# Altium schematic sheet SAML21_Xplained_Pro_Connectors.SchDoc: Extension connectors
size A3; Organization: ATMEL Norway; Address1: Vestre Rosten 79; Address2: N-7075 TILLER; Address3: NORWAY; DocumentNumber: A09-2241; Revision: 4; SheetNumber: 4; SheetTotal: 10; PageSetup: Record=PageOptions|CenterHorizontal=True|CenterVertical=True|PrintScale=1.01|XCorrection=1.00|YCorrection=1.00|PrintKind=1|BorderSize=5000000|LeftOffset=0|BottomOffset=0|Orientation=2|PaperLength=1000|PaperWidth=1000|Scale=100|PaperSource=7|PrintQuality=-4|MediaType=1|DitherType=10|PaperKind=A3 (297 x 420 mm)|PrintScaleMode=1
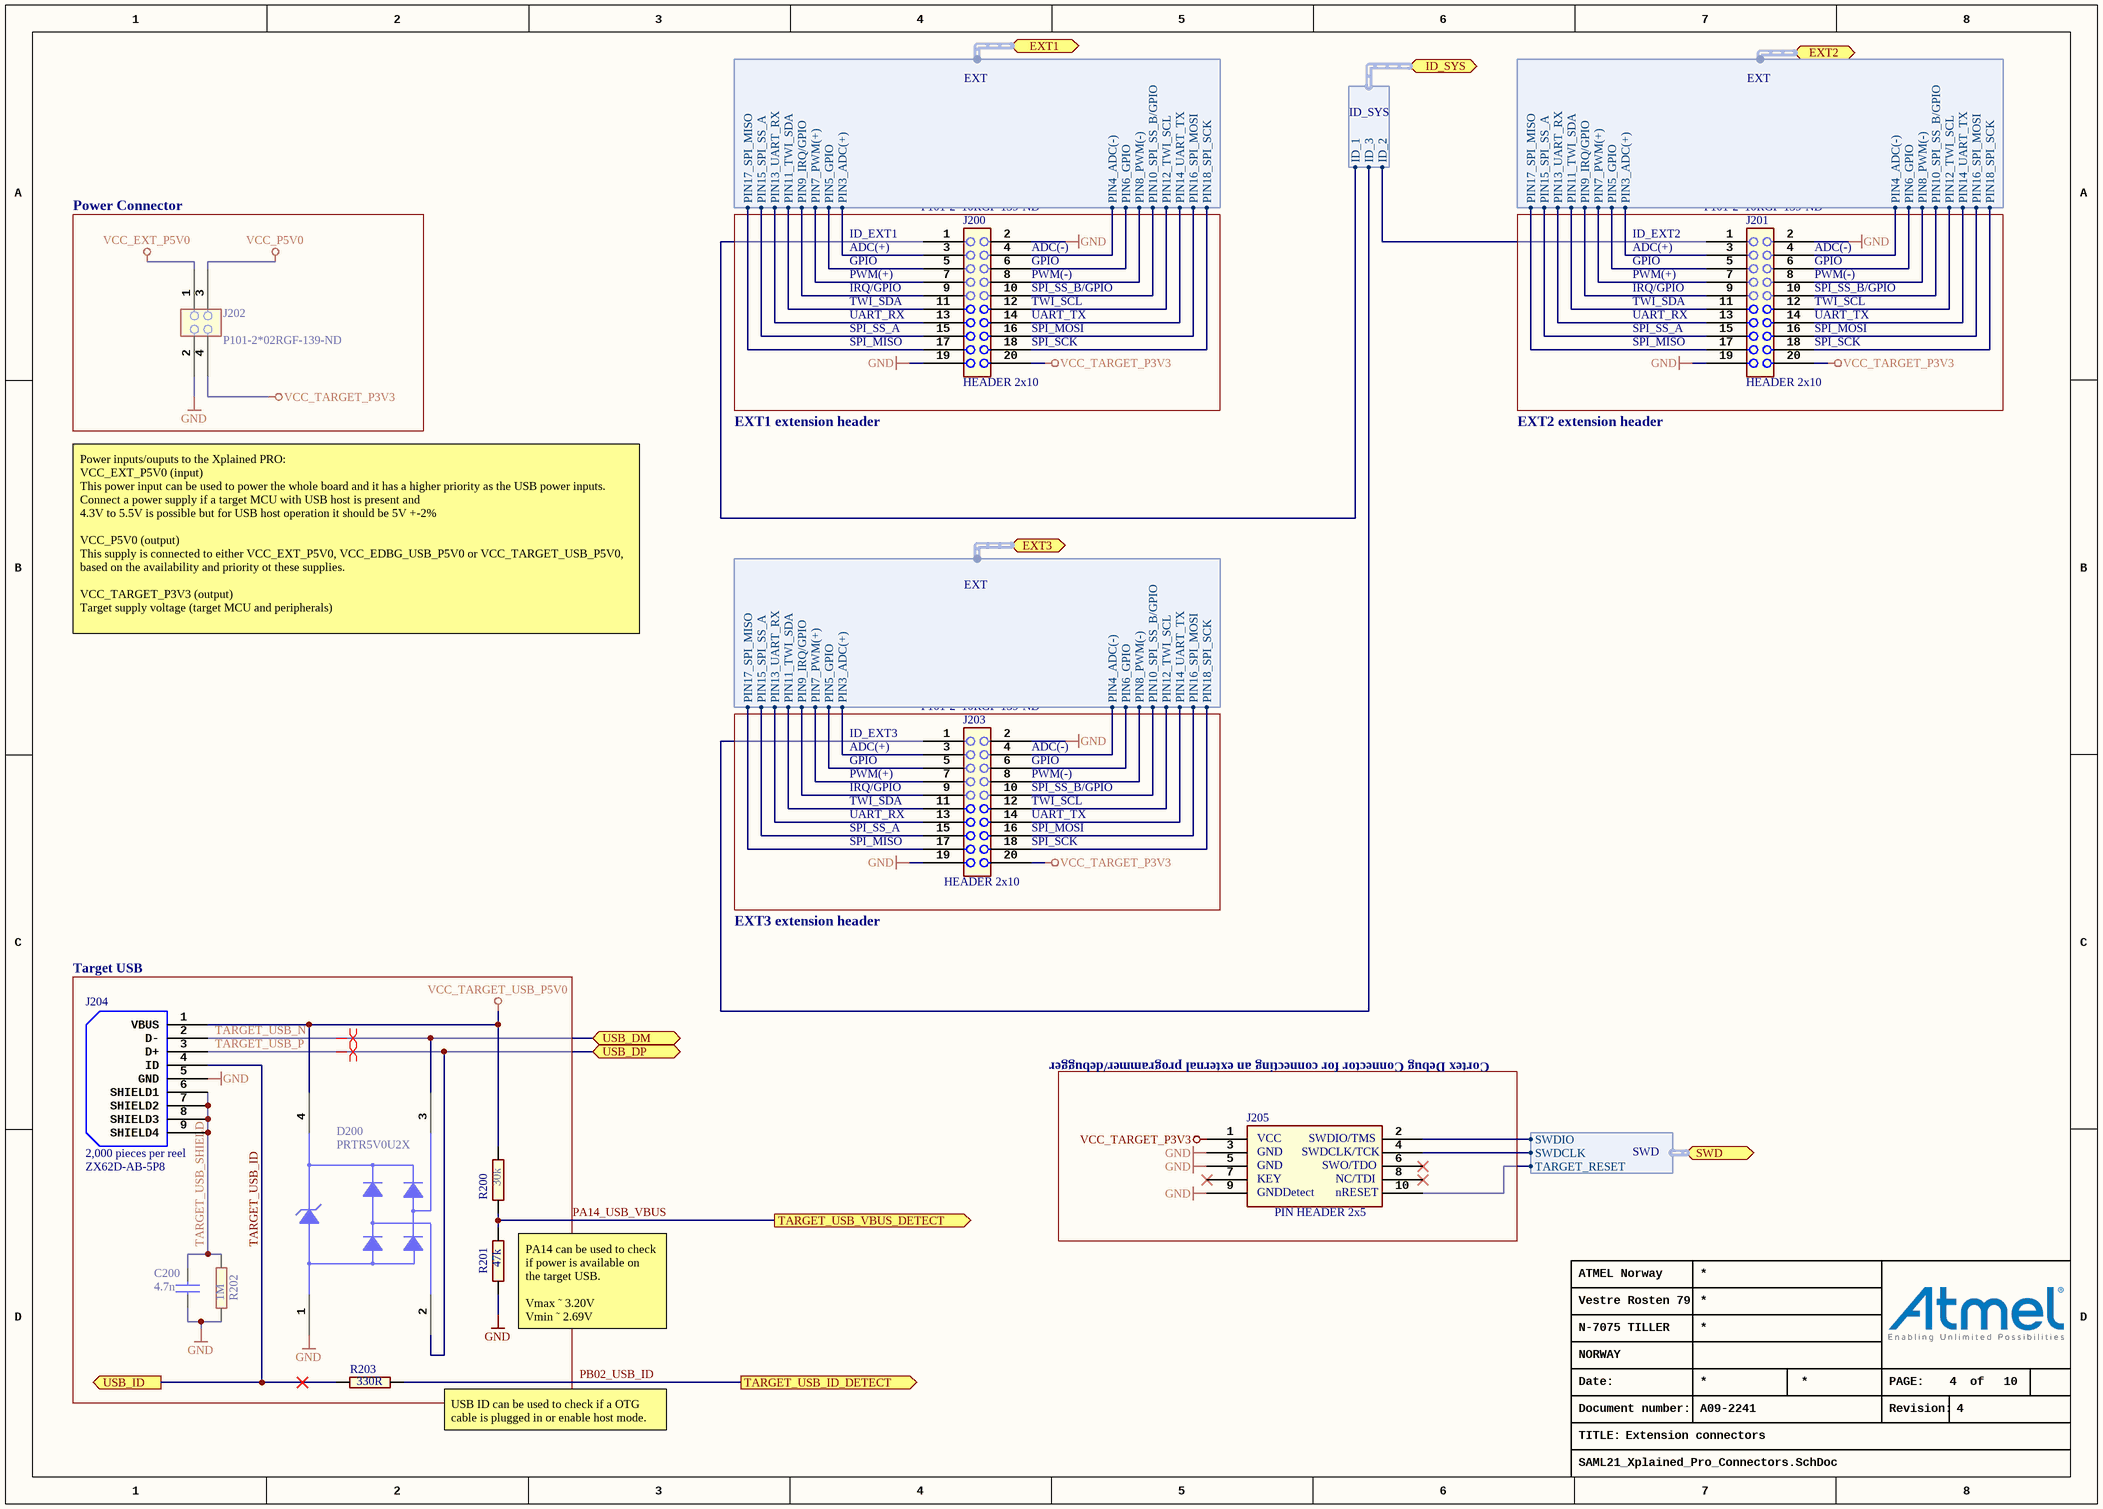
[diagram p0: SAML21_Xplained_Pro_Connectors.SchDoc]

## Parts
C200  value 4.7n  [AP1-00053]  (hidden comment: CAP-NONPOL)
D200  PRTR5V0U2X  [AP4-00001]
J200  HEADER 2x10  value P101-2*10RGF-139-ND  [AP8-00622]
J201  HEADER 2x10  value P101-2*10RGF-139-ND  [AP8-00622]
J202  value P101-2*02RGF-139-ND  [AP8-00628]  (hidden comment: HEADER 2x2)
J203  HEADER 2x10  value P101-2*10RGF-139-ND  [AP8-00622]
J204  2,000 pieces per reel  value ZX62D-AB-5P8  [AP8-00852]
J205  value PIN HEADER 2x5  [AP8-00257]  (hidden comment: HEADER 2x5)
R200  value 30k  [AP2-00011]  (hidden comment: R2)
R201  value 47k  [AP2-00011]  (hidden comment: R2)
R202  value 1M  [AP2-00011]  (hidden comment: R2)
R203  value 330R  [AP2-00011]  (hidden comment: R2)

## Blocks framed on the sheet
Power Connector: J202
Target USB: C200 D200 J204 R200-R203

## Ports
EXT1 (harness EXT), EXT2 (harness EXT), EXT3 (harness EXT), ID_SYS (harness ID_SYS), SWD (harness SWD), TARGET_USB_ID_DETECT (out), TARGET_USB_VBUS_DETECT (out), USB_DM (bidir), USB_DP (bidir), USB_ID (out)

## Harnesses
ID_SYS: ID_1, ID_2, ID_3
EXT: PIN3_ADC(+), PIN4_ADC(-), PIN5_GPIO, PIN6_GPIO, PIN7_PWM(+), PIN8_PWM(-), PIN9_IRQ/GPIO, PIN10_SPI_SS_B/GPIO, PIN11_TWI_SDA, PIN12_TWI_SCL, PIN13_UART_RX, PIN14_UART_TX, PIN15_SPI_SS_A, PIN16_SPI_MOSI, PIN17_SPI_MISO, PIN18_SPI_SCK
SWD: SWDCLK, SWDIO, TARGET_RESET

## Nets
GND: C200.1 D200.1(GND) J200.2 J200.19 J201.2 J201.19 J202.2 J203.2 J203.19 J204.5(GND) J205.3 J205.5 J205.9 R201.1 R202.1
VCC_EXT_P5V0: J202.1
VCC_P5V0: J202.3
VCC_TARGET_P3V3: J200.20 J201.20 J202.4 J203.20 J205.1
VCC_TARGET_USB_P5V0: D200.4(VCC) J204.1(VBUS) R200.2
PA14_USB_VBUS: R200.1 R201.2 ; port TARGET_USB_VBUS_DETECT
PB02_USB_ID: R203.2 ; port TARGET_USB_ID_DETECT
TARGET_USB_ID: J204.4(ID) R203.1 ; port USB_ID
TARGET_USB_N: D200.3(I/O_2) J204.2(D-) ; port USB_DM
TARGET_USB_P: D200.2(I/O_1) J204.3(D+) ; port USB_DP
TARGET_USB_SHIELD: C200.2 J204.6(SHIELD1) J204.7(SHIELD2) J204.8(SHIELD3) J204.9(SHIELD4) R202.2
NetJ200_1: J200.1 ; port ID_SYS.ID_1
NetJ200_3: J200.3 ; port EXT1.PIN3_ADC(+)
NetJ200_4: J200.4 ; port EXT1.PIN4_ADC(-)
NetJ200_5: J200.5 ; port EXT1.PIN5_GPIO
NetJ200_6: J200.6 ; port EXT1.PIN6_GPIO
NetJ200_7: J200.7 ; port EXT1.PIN7_PWM(+)
NetJ200_8: J200.8 ; port EXT1.PIN8_PWM(-)
NetJ200_9: J200.9 ; port EXT1.PIN9_IRQ/GPIO
NetJ200_10: J200.10 ; port EXT1.PIN10_SPI_SS_B/GPIO
NetJ200_11: J200.11 ; port EXT1.PIN11_TWI_SDA
NetJ200_12: J200.12 ; port EXT1.PIN12_TWI_SCL
NetJ200_13: J200.13 ; port EXT1.PIN13_UART_RX
NetJ200_14: J200.14 ; port EXT1.PIN14_UART_TX
NetJ200_15: J200.15 ; port EXT1.PIN15_SPI_SS_A
NetJ200_16: J200.16 ; port EXT1.PIN16_SPI_MOSI
NetJ200_17: J200.17 ; port EXT1.PIN17_SPI_MISO
NetJ200_18: J200.18 ; port EXT1.PIN18_SPI_SCK
NetJ201_1: J201.1 ; port ID_SYS.ID_2
NetJ201_3: J201.3 ; port EXT2.PIN3_ADC(+)
NetJ201_4: J201.4 ; port EXT2.PIN4_ADC(-)
NetJ201_5: J201.5 ; port EXT2.PIN5_GPIO
NetJ201_6: J201.6 ; port EXT2.PIN6_GPIO
NetJ201_7: J201.7 ; port EXT2.PIN7_PWM(+)
NetJ201_8: J201.8 ; port EXT2.PIN8_PWM(-)
NetJ201_9: J201.9 ; port EXT2.PIN9_IRQ/GPIO
NetJ201_10: J201.10 ; port EXT2.PIN10_SPI_SS_B/GPIO
NetJ201_11: J201.11 ; port EXT2.PIN11_TWI_SDA
NetJ201_12: J201.12 ; port EXT2.PIN12_TWI_SCL
NetJ201_13: J201.13 ; port EXT2.PIN13_UART_RX
NetJ201_14: J201.14 ; port EXT2.PIN14_UART_TX
NetJ201_15: J201.15 ; port EXT2.PIN15_SPI_SS_A
NetJ201_16: J201.16 ; port EXT2.PIN16_SPI_MOSI
NetJ201_17: J201.17 ; port EXT2.PIN17_SPI_MISO
NetJ201_18: J201.18 ; port EXT2.PIN18_SPI_SCK
NetJ203_1: J203.1 ; port ID_SYS.ID_3
NetJ203_3: J203.3 ; port EXT3.PIN3_ADC(+)
NetJ203_4: J203.4 ; port EXT3.PIN4_ADC(-)
NetJ203_5: J203.5 ; port EXT3.PIN5_GPIO
NetJ203_6: J203.6 ; port EXT3.PIN6_GPIO
NetJ203_7: J203.7 ; port EXT3.PIN7_PWM(+)
NetJ203_8: J203.8 ; port EXT3.PIN8_PWM(-)
NetJ203_9: J203.9 ; port EXT3.PIN9_IRQ/GPIO
NetJ203_10: J203.10 ; port EXT3.PIN10_SPI_SS_B/GPIO
NetJ203_11: J203.11 ; port EXT3.PIN11_TWI_SDA
NetJ203_12: J203.12 ; port EXT3.PIN12_TWI_SCL
NetJ203_13: J203.13 ; port EXT3.PIN13_UART_RX
NetJ203_14: J203.14 ; port EXT3.PIN14_UART_TX
NetJ203_15: J203.15 ; port EXT3.PIN15_SPI_SS_A
NetJ203_16: J203.16 ; port EXT3.PIN16_SPI_MOSI
NetJ203_17: J203.17 ; port EXT3.PIN17_SPI_MISO
NetJ203_18: J203.18 ; port EXT3.PIN18_SPI_SCK
NetJ205_2: J205.2 ; port SWD.SWDIO
NetJ205_4: J205.4 ; port SWD.SWDCLK
NetJ205_10: J205.10 ; port SWD.TARGET_RESET

Not connected (* = marked no-connect by the designer): J205 6* 7* 8*

## Layout directives
differential pair; rule Assembly Testpoint Usage [Testpoint - Not Allowed    Multiple - Not Allowed]: TARGET_USB_N, TARGET_USB_P

## Notes on the sheet
- ID_EXT1
- ID_EXT2
- ADC(+)
- GPIO
- PWM(+)
- IRQ/GPIO
- TWI_SDA
- UART_RX
- (near J200) ADC(-)
- (near J200) GPIO
- (near J200) PWM(-)
- (near J200) SPI_SS_B/GPIO
- (near J200) TWI_SCL
- (near J200) UART_TX
- (near J201) ADC(-)
- (near J201) GPIO
- (near J201) PWM(-)
- (near J201) SPI_SS_B/GPIO
- (near J201) TWI_SCL
- (near J201) UART_TX
- SPI_SS_A
- SPI_MISO
- (near J200) SPI_MOSI
- (near J200) SPI_SCK
- (near J201) SPI_MOSI
- (near J201) SPI_SCK
- EXT1 extension header
- EXT2 extension header
- Power inputs/ouputs to the Xplained PRO:
  VCC_EXT_P5V0 (input)
  This power input can be used to power the whole board and it has a higher priority as the USB power inputs. Connect a power supply if a target MCU with USB host is present and
  4.3V to 5.5V is possible but for USB host operation it should be 5V +-2%
  VCC_P5V0 (output)
  This supply is connected to either VCC_EXT_P5V0, VCC_EDBG_USB_P5V0 or VCC_TARGET_USB_P5V0, based on the availability and priority ot these supplies.
  VCC_TARGET_P3V3 (output)
  Target supply voltage (target MCU and peripherals)
- ID_EXT3
- (near J203) ADC(-)
- (near J203) GPIO
- (near J203) PWM(-)
- (near J203) SPI_SS_B/GPIO
- (near J203) TWI_SCL
- (near J203) UART_TX
- (near J203) SPI_MOSI
- (near J203) SPI_SCK
- EXT3 extension header
- Cortex Debug Connector for connecting an external programmer/debugger
- (near R201) PA14 can be used to check
  if power is available on
  the target USB.
  Vmax ˜ 3.20V
  Vmin ˜ 2.69V
- USB ID can be used to check if a OTG cable is plugged in or enable host mode.
- Date:
- PAGE:
- of
- TITLE:
- Document number:
- Revision:
- (in symbol A08-0385) VCC; SWDIO/TMS; GND; SWDCLK/TCK; SWO/TDO; KEY; NC/TDI; GNDDetect; nRESET

## Library data of the parts
C200 = A01-0046: Ceramic capacitor, SMD 0402, X7R, 25V, +/-10%; PartGroup: Capacitors,Ceramic,SMD 0402; TemperatureRange: -55 - +125 deg C; AN: A01-0046; Tolerance: 25V, +/-10%; Height: 0.550000011920929
D200 = A06-0236: Double rail-to-rail USB ESD protection diode; OrcadPartType: Integrated Circuits&Special function&Protection; Manufacturer: Philips; TemperatureRange: -40 to +85 C; AN: A06-0236; Value: PRTR5V0U2X; PartType: Buy; Height: 1,10000002384186; MPN: PRTR5V0U2X
J200 J201 J203 = A08-1513: Pin header, 2x10, Right Angle, 2.54mm, THM, Pin In Paste; PartGroup: Mechanical devices,Connectors,Pin headers; AN: A08-1513; MPN: P101-2*10RGF-139-ND
J202 = A08-1519: Pin header, 2x2, Right Angle, 2.54mm, THT, Pin In Paste; PartGroup: Mechanical devices,Connectors,Pin headers; AN: A08-1519; Height: 5.07999992370605; MPN: P101-2*02RGF-139-ND
J204 = A08-2112: Micro USB AB Connector, Standard SMT + DIP; PartGroup: Mechanical devices,Connectors,USB; AN: A08-2112; Height: 2.79999995231628
J205 = A08-0385: 2x5 pin header, 1.27mm pitch, THM; PartGroup: Mechanical devices,Connectors,Pin headers; Manufacturer: Garry; MPN: STL21-0730 G TT-10U; AN: A08-0385; Height: 7,30000019073486
R200 = A02-0247: Thick film resistor, SMD 0402, 1/16W, 1%; PartGroup: Resistors,SMD,0402 1%; TemperatureRange: -55 - +125 deg C; AN: A02-0247; Tolerance: 1 %; Height: 0.349999994039536
R201 = A02-0252: Thick film resistor, SMD 0402, 1/16W, 1%; PartGroup: Resistors,SMD,0402 1%; TemperatureRange: -55 - +125 deg C; AN: A02-0252; Tolerance: 1 %; Height: 0.349999994039536
R202 = A02-0284: Thick film resistor, SMD 0402, 1/16W, 1%; PartGroup: Resistors,SMD,0402 1%; Manufacturer: KOA; MPN: RK73H1ETTP1004F; TemperatureRange: -55 - +125 deg C; AN: A02-0284; Tolerance: 1 %; Height: 0,349999994039536
R203 = A02-0200: Thick film resistor, SMD 0402, 1/16W, 1%; PartGroup: Resistors,SMD,0402 1%; TemperatureRange: -55 - +125 deg C; AN: A02-0200; Tolerance: 1 %; Height: 0.349999994039536